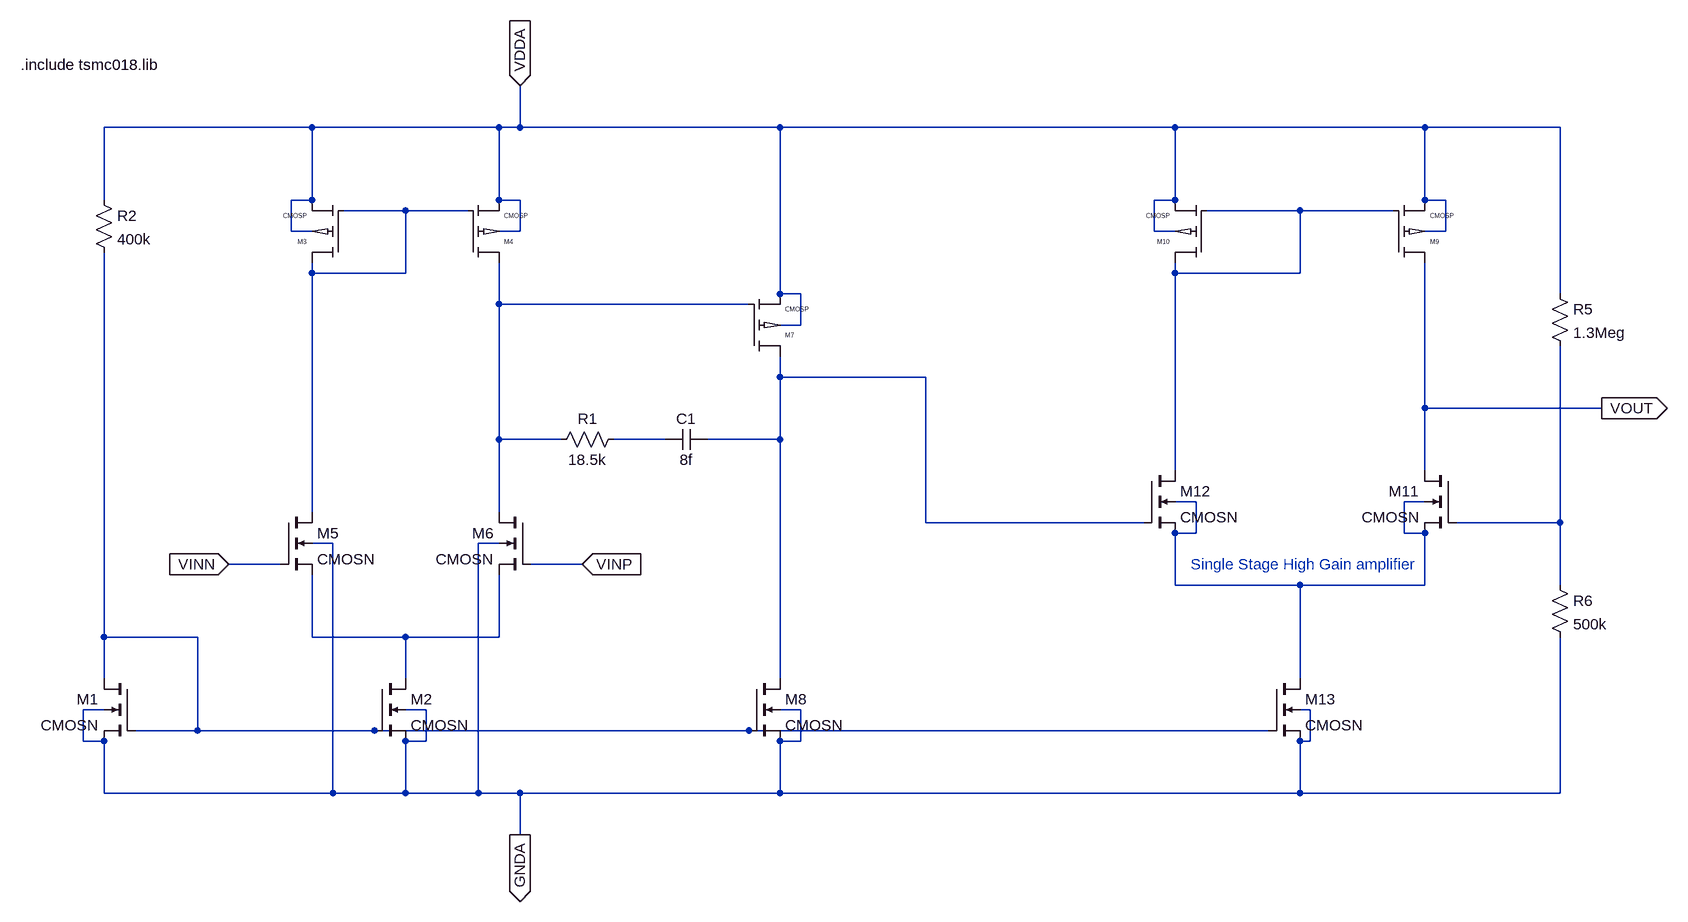
[diagram p0: schematic Inrush_Current_Protection_Circuit.asc]
Inrush_Current_Protection_Circuit.asc, the LTspice schematic file:
Version 4
SHEET 1 3180 960
WIRE 800 -256 480 -256
WIRE 1088 -256 800 -256
WIRE 1120 -256 1120 -320
WIRE 1120 -256 1088 -256
WIRE 1520 -256 1120 -256
WIRE 2128 -256 1520 -256
WIRE 2512 -256 2128 -256
WIRE 2720 -256 2512 -256
WIRE 480 -144 480 -256
WIRE 800 -144 800 -256
WIRE 800 -144 768 -144
WIRE 1088 -144 1088 -256
WIRE 1120 -144 1088 -144
WIRE 2128 -144 2128 -256
WIRE 2128 -144 2096 -144
WIRE 2512 -144 2512 -256
WIRE 2544 -144 2512 -144
WIRE 944 -128 848 -128
WIRE 1040 -128 944 -128
WIRE 2320 -128 2176 -128
WIRE 2464 -128 2320 -128
WIRE 768 -96 768 -144
WIRE 800 -96 768 -96
WIRE 1120 -96 1120 -144
WIRE 1120 -96 1088 -96
WIRE 2096 -96 2096 -144
WIRE 2128 -96 2096 -96
WIRE 2544 -96 2544 -144
WIRE 2544 -96 2512 -96
WIRE 800 -32 800 -48
WIRE 944 -32 944 -128
WIRE 944 -32 800 -32
WIRE 2128 -32 2128 -48
WIRE 2320 -32 2320 -128
WIRE 2320 -32 2128 -32
WIRE 1520 0 1520 -256
WIRE 1552 0 1520 0
WIRE 2720 0 2720 -256
WIRE 1088 16 1088 -48
WIRE 1472 16 1088 16
WIRE 1552 48 1552 0
WIRE 1552 48 1520 48
WIRE 1520 128 1520 96
WIRE 1744 128 1520 128
WIRE 2512 176 2512 -48
WIRE 2784 176 2512 176
WIRE 1088 224 1088 16
WIRE 1184 224 1088 224
WIRE 1344 224 1264 224
WIRE 1520 224 1520 128
WIRE 1520 224 1408 224
WIRE 2128 272 2128 -32
WIRE 2512 272 2512 176
WIRE 2160 320 2128 320
WIRE 2512 320 2480 320
WIRE 800 336 800 -32
WIRE 1088 336 1088 224
WIRE 1744 352 1744 128
WIRE 2080 352 1744 352
WIRE 2720 352 2720 80
WIRE 2720 352 2560 352
WIRE 2160 368 2160 320
WIRE 2160 368 2128 368
WIRE 2480 368 2480 320
WIRE 2512 368 2480 368
WIRE 832 384 800 384
WIRE 1088 384 1056 384
WIRE 752 416 672 416
WIRE 1216 416 1136 416
WIRE 2128 448 2128 368
WIRE 2320 448 2128 448
WIRE 2512 448 2512 368
WIRE 2512 448 2320 448
WIRE 2720 448 2720 352
WIRE 480 528 480 -64
WIRE 624 528 480 528
WIRE 800 528 800 432
WIRE 944 528 800 528
WIRE 1088 528 1088 432
WIRE 1088 528 944 528
WIRE 480 592 480 528
WIRE 944 592 944 528
WIRE 1520 592 1520 224
WIRE 2320 592 2320 448
WIRE 480 640 448 640
WIRE 976 640 944 640
WIRE 1552 640 1520 640
WIRE 2336 640 2320 640
WIRE 624 672 624 528
WIRE 624 672 528 672
WIRE 896 672 624 672
WIRE 1472 672 896 672
WIRE 2272 672 1472 672
WIRE 448 688 448 640
WIRE 480 688 448 688
WIRE 976 688 976 640
WIRE 976 688 944 688
WIRE 1552 688 1552 640
WIRE 1552 688 1520 688
WIRE 2336 688 2336 640
WIRE 2336 688 2320 688
WIRE 480 768 480 688
WIRE 832 768 832 384
WIRE 832 768 480 768
WIRE 944 768 944 688
WIRE 944 768 832 768
WIRE 1056 768 1056 384
WIRE 1056 768 944 768
WIRE 1120 768 1056 768
WIRE 1520 768 1520 688
WIRE 1520 768 1120 768
WIRE 2320 768 2320 688
WIRE 2320 768 1520 768
WIRE 2720 768 2720 528
WIRE 2720 768 2320 768
WIRE 1120 832 1120 768
FLAG 1120 -320 VDDA
IOPIN 1120 -320 In
FLAG 1120 832 GNDA
IOPIN 1120 832 Out
FLAG 2784 176 VOUT
IOPIN 2784 176 Out
FLAG 672 416 VINN
IOPIN 672 416 In
FLAG 1216 416 VINP
IOPIN 1216 416 In
SYMBOL cmosn 528 592 M0
SYMATTR InstName M1
SYMATTR Value2 l=180n w=1u
SYMBOL cmosn 896 592 R0
SYMATTR InstName M2
SYMATTR Value2 l=180n w=3u
SYMBOL cmosp 848 -48 R180
SYMATTR InstName M3
SYMATTR Value2 l=180n w=2u
SYMBOL cmosp 1040 -48 M180
SYMATTR InstName M4
SYMATTR Value2 l=180n w=2u
SYMBOL cmosn 752 336 R0
SYMATTR InstName M5
SYMATTR Value2 l=180n w=1u
SYMBOL cmosn 1136 336 M0
SYMATTR InstName M6
SYMATTR Value2 l=180n w=1u
SYMBOL cmosp 1472 96 M180
SYMATTR InstName M7
SYMATTR Value2 l=180n w=10u
SYMBOL cmosn 1472 592 R0
SYMATTR InstName M8
SYMATTR Value2 l=180n w=3u
SYMBOL res 464 -160 R0
SYMATTR InstName R2
SYMATTR Value 400k
SYMBOL cmosp 2464 -48 M180
SYMATTR InstName M9
SYMATTR Value2 l=180n w=1u
SYMBOL cmosp 2176 -48 R180
SYMATTR InstName M10
SYMATTR Value2 l=180n w=1u
SYMBOL cmosn 2560 272 M0
SYMATTR InstName M11
SYMATTR Value2 l=180n w=270n
SYMBOL cmosn 2080 272 R0
SYMATTR InstName M12
SYMATTR Value2 l=180n w=270n
SYMBOL cmosn 2272 592 R0
SYMATTR InstName M13
SYMATTR Value2 l=720n w=2u
SYMBOL res 2704 -16 R0
SYMATTR InstName R5
SYMATTR Value 1.3Meg
SYMBOL res 2704 432 R0
SYMATTR InstName R6
SYMATTR Value 500k
SYMBOL cap 1408 208 R90
WINDOW 0 0 32 VBottom 2
WINDOW 3 32 32 VTop 2
SYMATTR InstName C1
SYMATTR Value 8f
SYMBOL res 1280 208 R90
WINDOW 0 0 56 VBottom 2
WINDOW 3 32 56 VTop 2
SYMATTR InstName R1
SYMATTR Value 18.5k
TEXT 352 -352 Left 2 !.include tsmc018.lib
TEXT 2152 416 Left 2 ;Single Stage High Gain amplifier

The netlist it stands for:
* Inrush_Current_Protection_Circuit.asc
M1 N008 N008 GNDA GNDA CMOSN l=180n w=1u
M2 N009 N008 GNDA GNDA CMOSN l=180n w=3u
M3 N001 N001 VDDA VDDA CMOSP l=180n w=2u
M4 N003 N001 VDDA VDDA CMOSP l=180n w=2u
M5 N001 VINN N009 GNDA CMOSN l=180n w=1u
M6 N003 VINP N009 GNDA CMOSN l=180n w=1u
M7 N004 N003 VDDA VDDA CMOSP l=180n w=10u
M8 N004 N008 GNDA GNDA CMOSN l=180n w=3u
R2 VDDA N008 400k
M9 VOUT N002 VDDA VDDA CMOSP l=180n w=1u
M10 N002 N002 VDDA VDDA CMOSP l=180n w=1u
M11 VOUT N007 N006 N006 CMOSN l=180n w=270n
M12 N002 N004 N006 N006 CMOSN l=180n w=270n
M13 N006 N008 GNDA GNDA CMOSN l=720n w=2u
R5 VDDA N007 1.3Meg
R6 N007 GNDA 500k
C1 N004 N005 8f
R1 N005 N003 18.5k
.model NMOS NMOS
.model PMOS PMOS
.lib standard.mos
.include tsmc018.lib
* Single Stage High Gain amplifier
.lib tsmc018.lib
.backanno
.end